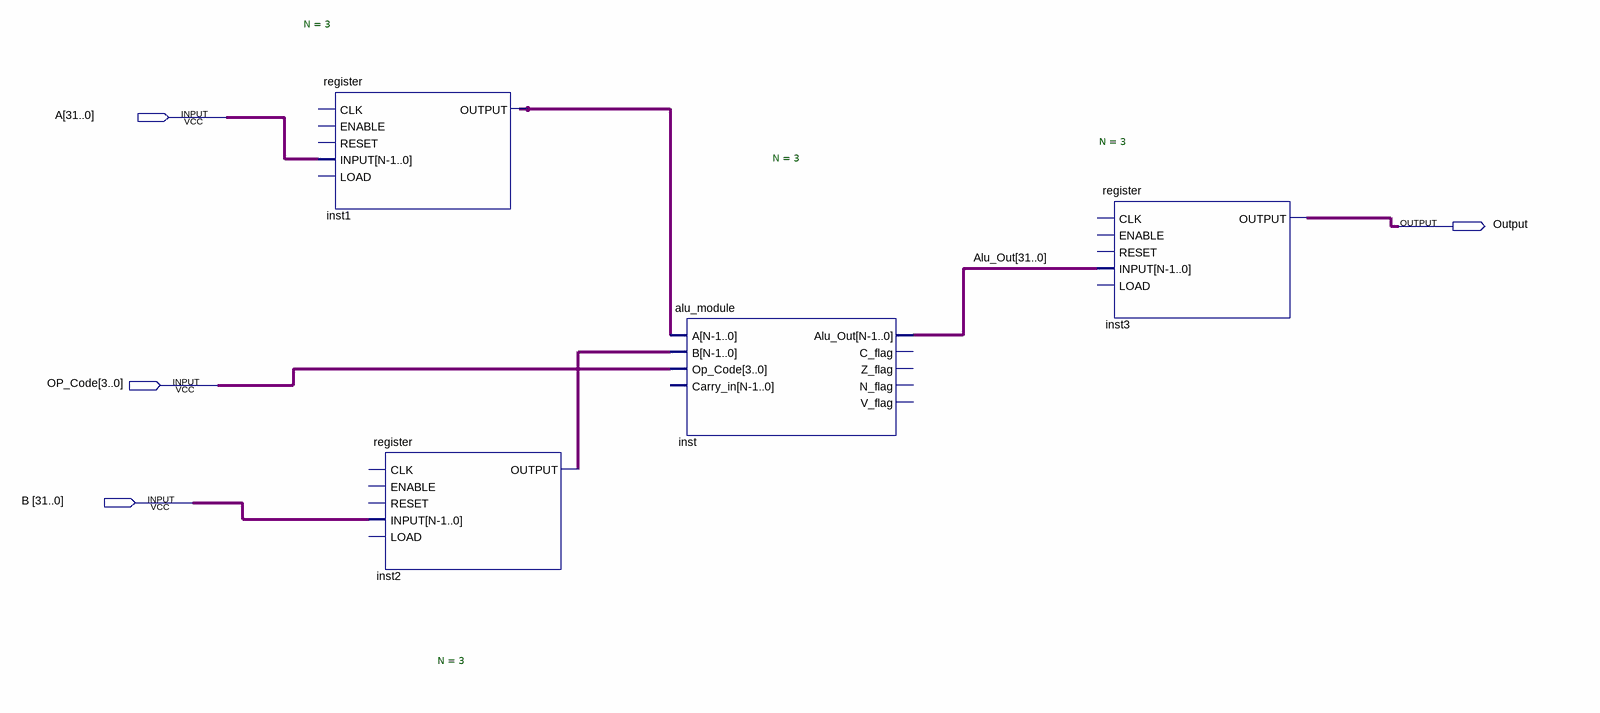
[diagram p0: schematic sheet]
// Quartus schematic alu_module_schematic.bdf as structural Verilog: 4 symbols, 4 pins
module alu_module_schematic (
  input  [31:0] A,
  input  [3:0] OP_Code,
  input  [31:0] B,
  output Output
);

  wire [2:0] inst1_output, inst2_output;
  wire [31:0] Alu_Out;

  register #(.N(3)) inst1 (.INPUT(A), .OUTPUT(inst1_output));  // open: CLK, ENABLE, RESET, LOAD
  register #(.N(3)) inst2 (.INPUT(B), .OUTPUT(inst2_output));  // open: CLK, ENABLE, RESET, LOAD
  alu_module #(.N(3)) inst (
    .A(inst1_output), .B(inst2_output), .Op_Code(OP_Code), .Alu_Out(Alu_Out));  // open: Carry_in, C_flag, Z_flag, N_flag, V_flag
  register #(.N(3)) inst3 (.INPUT(Alu_Out), .OUTPUT(Output));  // open: CLK, ENABLE, RESET, LOAD
endmodule
